# Altium schematic sheet Sheet1.SchDoc
size A3; SheetNumber: 1; SheetTotal: 1
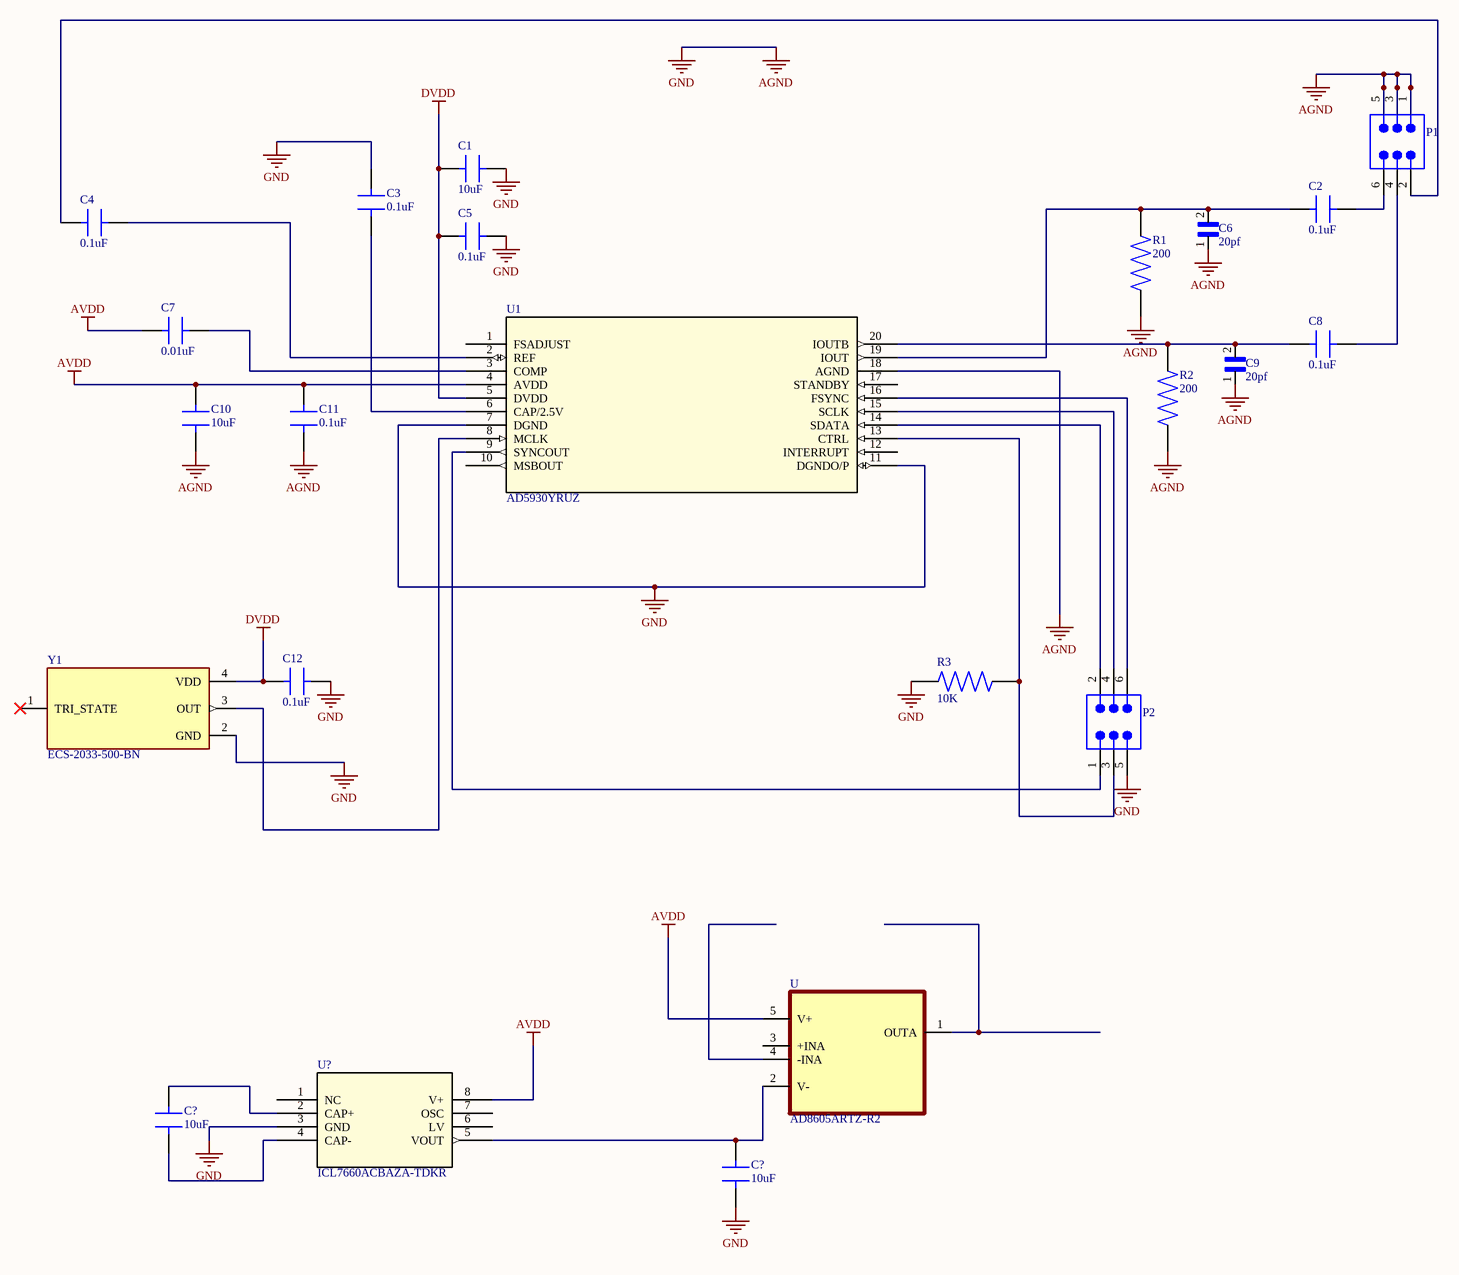
[diagram p0: Sheet1.SchDoc]

## Parts
(Parts that share a designator on the sheet are numbered #1, #2 ... from top to bottom, then left to right.)
C1  10uF  [CAPC1608X100N]
C2  0.1uF  [CHHOT]
C3  0.1uF  [CHHOT]
C4  0.1uF  [CHHOT]
C5  0.1uF  [CHHOT]
C6  20pf  [CAPC1608X87N]
C7  0.01uF  [CHHOT]
C8  0.1uF  [CHHOT]
C9  20pf  [CAPC1608X87N]
C10  10uF  [CAPC1608X100N]
C11  0.1uF  [CHHOT]
C12  0.1uF  [CHHOT]
C?#1  10uF  [CAPC1608X100N]
C?#2  10uF  [CAPC1608X100N]
P1  61200621621  [61200621621]  (value not drawn)
P2  61200621621  [61200621621]  (value not drawn)
R1  200  [RESC1608X55N]
R2  200  [RESC1608X55N]
R3  10K  [RESC1005X35N]
U  AD8605ARTZ-R2  [SOT95P290X145-5N]
U1  AD5930YRUZ  [RU_20_ADI]
U?  ICL7660ACBAZA-TDKR  [SOIC8_4X5_INR]
Y1  ECS-2033-500-BN  [OSC_ECS-2033-500-BN]

## Nets
AGND: C1.1 C3.2 C5.1 C6.1 C9.1 C10.1 C11.1 C12.1 C?#2.1 P1.1 P1.3 P1.5 P2.5 R1.1 R2.1 R3.1 U1.7(DGND) U1.11(DGNDO/P) U1.18(AGND) U?.3(GND) Y1.2(GND)  [also labelled GND]
AVDD: C7.1 C10.2 C11.2 U.5(V+) U1.4(AVDD) U?.8(V+)
DVDD: C1.2 C5.2 C12.2 U1.5(DVDD) Y1.4(VDD)
NetC2_1: C2.1 P1.6
NetC2_2: C2.2 C6.2 R1.2 U1.19(IOUT)
NetC3_1: C3.1 U1.6(CAP/2.5V)
NetC4_1: C4.1 U1.2(REF)
NetC4_2: C4.2 P1.2
NetC7_2: C7.2 U1.3(COMP)
NetC8_1: C8.1 P1.4
NetC8_2: C8.2 C9.2 R2.2 U1.20(IOUTB)
NetC?#1_1: C?#1.1 U?.4(CAP-)
NetC?#1_2: C?#1.2 U?.2(CAP+)
NetC?#2_2: C?#2.2 U.2(V-) U?.5(VOUT)
NetP2_1: P2.1 U1.9(SYNCOUT)
NetP2_2: P2.2 U1.14(SDATA)
NetP2_3: P2.3 R3.2 U1.13(CTRL)
NetP2_4: P2.4 U1.15(SCLK)
NetP2_6: P2.6 U1.16(FSYNC)
NetU1_8: U1.8(MCLK) Y1.3(OUT)

Not connected (* = marked no-connect by the designer): U 1(OUTA) 3(+INA) 4(-INA); U1 1(FSADJUST) 10(MSBOUT) 12(INTERRUPT) 17(STANDBY); U? 1(NC) 6(LV) 7(OSC); Y1 1(TRI_STATE)*

## Library data of the parts
C1 C10 C?#1 C?#2 = GRM188R61A106ME69D: Ceramic Capacitor, Multilayer, Ceramic, 10V, 20% +Tol, 20% -Tol, X5R, 15% TC, 10uF, Surface Mount, 0603; Manufacturer: Murata; Multilayer: Yes; Supplier: Digikey; Supplier Part Number: 490-10475-1-ND; Manufacturer Part Number: GRM188R61A106ME69D; RoHS: Yes; Category: Ceramic Capacitors; Stock: 1017904; Pricing: 1=0.14, 10=0.098, 50=0.0584, 100=0.0459, 500=0.03392, 1000=0.02809 (USD); Mounting Technology: Surface Mount; Pins: 2; Dielectric Material: Ceramic; Package Shape: Rectangular; Case/Package: 0603; Terminal Finish: Nickel; Min Operating Temperature: -55°C; Max Operating Temperature: 85°C; JESD-609 Code: e3; Value: 10uF; Capacitor Type: Ceramic; Tolerance  (fill in as +-): 20%; Packaging: Tape and Reel; Tolerance (fill in as +-): 20%; Rated DC Voltage (URdc): 10V; Temperature Characteristics Code: X5R; Termination: Wraparound; Reach SVHC Compliant: Yes; RoHS Compliant: Yes; ComponentLink1URL: https://datasheet.ciiva.com:443/pdfs/VipMasterIC/IC/MURE/MURE-S-A0004349797/MURE-S-A0004352786-1.pdf?src-supplier=IHS+Markit; ComponentLink1Description: https://datasheet.ciiva.com:443/pdfs/VipMasterIC/IC/MURE/MURE-S-A0004349797/MURE-S-A0004352786-1.pdf?src-supplier=IHS+Markit; ComponentLink2URL: http://www.farnell.com/datasheets/1872210.pdf?src-supplier=Farnell; ComponentLink2Description: http://www.farnell.com/datasheets/1872210.pdf?src-supplier=Farnell; ComponentLink3URL: http://www.mouser.com/ds/2/281/c02e-2905.pdf?src-supplier=Mouser; ComponentLink3Description: http://www.mouser.com/ds/2/281/c02e-2905.pdf?src-supplier=Mouser; ComponentLink4URL: http://www.farnell.com/datasheets/1872210.pdf?src-supplier=Newark; ComponentLink4Description: http://www.farnell.com/datasheets/1872210.pdf?src-supplier=Newark; ComponentLink5URL: http://www.farnell.com/datasheets/2048014.pdf?src-supplier=Element14; ComponentLink5Description: http://www.farnell.com/datasheets/2048014.pdf?src-supplier=Element14; ComponentLink6URL: https://datasheet.octopart.com/GRM188R61A106ME69D-Murata-datasheet-62317187.pdf?src-supplier=Element14; ComponentLink6Description: https://datasheet.octopart.com/GRM188R61A106ME69D-Murata-datasheet-62317187.pdf?src-supplier=Element14; ComponentLink7URL: http://search.murata.co.jp/Ceramy/image/img/A01X/G101/ENG/GRM188R61A106ME69-01.pdf?src-supplier=Digikey; ComponentLink7Description: http://search.murata.co.jp/Ceramy/image/img/A01X/G101/ENG/GRM188R61A106ME69-01.pdf?src-supplier=Digikey; ComponentLink8URL: https://datasheet.octopart.com/GRM188R61A106ME69D-Murata-datasheet-22122223.pdf?src-supplier=Future+Electronics; ComponentLink8Description: https://datasheet.octopart.com/GRM188R61A106ME69D-Murata-datasheet-22122223.pdf?src-supplier=Future+Electronics
C2-C5 C8 C11 C12 = GRM155R71C104KA88J: Ceramic Capacitor, Multilayer, Ceramic, 16V, 10% +Tol, 10% -Tol, X7R, 15% TC, 0.1uF, Surface Mount, 0402; Manufacturer: Murata; Value: 100nF; Multilayer: Yes; Supplier: Digikey; Supplier Part Number: 490-6328-1-ND; Manufacturer Part Number: GRM155R71C104KA88J; RoHS: Yes; Category: Ceramic Capacitors; Stock: 19507793; Pricing: 1=0.1, 10=0.019, 50=0.011, 100=0.0086, 500=0.00646, 1000=0.00508, 2500=0.00462, 5000=0.00425 (USD); Mounting Technology: Surface Mount; Pins: 2; Dielectric Material: Ceramic; Package Shape: Rectangular; Case/Package: 0402; Terminal Finish: Nickel; Min Operating Temperature: -55°C; Max Operating Temperature: 125°C; JESD-609 Code: e3; Capacitor Type: Ceramic; Tolerance  (fill in as +-): 10%; Package Style: SMTMeter; Packaging: Tape and Reel; Tolerance (fill in as +-): 10%; Rated DC Voltage (URdc): 16V; Temperature Characteristics Code: X7R; Termination: Wraparound; Length: 1mm; Width: 0.5mm; Height: 0.5mm; Reach SVHC Compliant: Yes; RoHS Compliant: Yes; ComponentLink1URL: https://psearch.en.murata.com:443/capacitor/product/GRM155R71C104KA88%23.pdf?src-supplier=IHS+Markit; ComponentLink1Description: https://psearch.en.murata.com:443/capacitor/product/GRM155R71C104KA88%23.pdf?src-supplier=IHS+Markit; ComponentLink2URL: https://datasheet.ciiva.com/6271/product-6271168.pdf?src-supplier=Digikey; ComponentLink2Description: https://datasheet.ciiva.com/6271/product-6271168.pdf?src-supplier=Digikey; ComponentLink3URL: https://datasheet.ciiva.com/6271/grm155r71c104ka88-01-6271231.pdf?src-supplier=Digikey; ComponentLink3Description: https://datasheet.ciiva.com/6271/grm155r71c104ka88-01-6271231.pdf?src-supplier=Digikey
C6 C9 = C0603C200C3GAC7867: Package: None; Price: None; Value: *; MP: C0603C200C3GAC7867; Availability: Unavailable
C7 = GRM155R71E103KA01D: Ceramic Capacitor, Multilayer, Ceramic, 25V, 10% +Tol, 10% -Tol, X7R, 15% TC, 0.01uF, Surface Mount, 0402; Manufacturer: Murata; Value: 10nF; Multilayer: Yes; Supplier: Digikey; Supplier Part Number: 490-1312-1-ND; Manufacturer Part Number: GRM155R71E103KA01D; RoHS: Yes; Category: Ceramic Capacitors; Stock: 9603416; Pricing: 1=0.1, 10=0.028, 50=0.016, 100=0.0125, 500=0.00938, 1000=0.00736, 2500=0.0067, 5000=0.00616 (USD); Mounting Technology: Surface Mount; Pins: 2; Dielectric Material: Ceramic; Package Shape: Rectangular; Case/Package: 0402; Terminal Finish: Nickel; Min Operating Temperature: -55°C; Max Operating Temperature: 125°C; JESD-609 Code: e3; Capacitor Type: Ceramic; Tolerance  (fill in as +-): 10%; Package Style: SMTMeter; Packaging: Tape and Reel; Tolerance (fill in as +-): 10%; Rated DC Voltage (URdc): 25V; Temperature Characteristics Code: X7R; Termination: Wraparound; Length: 1mm; Width: 0.5mm; Height: 0.5mm; Reach SVHC Compliant: Yes; RoHS Compliant: Yes; ComponentLink1URL: https://psearch.en.murata.com:443/capacitor/product/GRM155R71E103KA01%23.pdf?src-supplier=IHS+Markit; ComponentLink1Description: https://psearch.en.murata.com:443/capacitor/product/GRM155R71E103KA01%23.pdf?src-supplier=IHS+Markit; ComponentLink2URL: https://datasheet.ciiva.com/28534/1699889-28534148.pdf?src-supplier=Element14; ComponentLink2Description: https://datasheet.ciiva.com/28534/1699889-28534148.pdf?src-supplier=Element14; ComponentLink3URL: https://datasheet.ciiva.com/129/partnumbering-e-01-129742.pdf?src-supplier=Digikey; ComponentLink3Description: https://datasheet.ciiva.com/129/partnumbering-e-01-129742.pdf?src-supplier=Digikey; ComponentLink4URL: https://datasheet.ciiva.com/129/partnumbering-e-01-129741.pdf?src-supplier=Digikey; ComponentLink4Description: https://datasheet.ciiva.com/129/partnumbering-e-01-129741.pdf?src-supplier=Digikey; ComponentLink5URL: https://datasheet.ciiva.com/129/partnumbering-e-01-129743.pdf?src-supplier=Digikey; ComponentLink5Description: https://datasheet.ciiva.com/129/partnumbering-e-01-129743.pdf?src-supplier=Digikey; ComponentLink6URL: https://datasheet.ciiva.com/11786/0900766b807a1cab-11786320.pdf?src-supplier=Rs; ComponentLink6Description: https://datasheet.ciiva.com/11786/0900766b807a1cab-11786320.pdf?src-supplier=Rs; ComponentLink7URL: https://datasheet.ciiva.com/3777/3813grm155r71e103ka0123-3777115.pdf?src-supplier=Arrow+Electronics; ComponentLink7Description: https://datasheet.ciiva.com/3777/3813grm155r71e103ka0123-3777115.pdf?src-supplier=Arrow+Electronics; ComponentLink8URL: https://datasheet.ciiva.com/18184/getdatasheetpartid-161489-18184689.pdf?src-supplier=Verical; ComponentLink8Description: https://datasheet.ciiva.com/18184/getdatasheetpartid-161489-18184689.pdf?src-supplier=Verical; ComponentLink9URL: https://datasheet.ciiva.com/29199/454154-da-01-en-vs-kondensator-0402-29199817.pdf?src-supplier=Conrad; ComponentLink9Description: https://datasheet.ciiva.com/29199/454154-da-01-en-vs-kondensator-0402-29199817.pdf?src-supplier=Conrad; ComponentLink10URL: https://datasheet.ciiva.com/7937/1747448-7937621.pdf?src-supplier=Element14; ComponentLink10Description: https://datasheet.ciiva.com/7937/1747448-7937621.pdf?src-supplier=Element14; ComponentLink11URL: https://datasheet.ciiva.com/16199/product-16199034.pdf?src-supplier=Future+Electronics; ComponentLink11Description: https://datasheet.ciiva.com/16199/product-16199034.pdf?src-supplier=Future+Electronics
P1 P2 = 61200621621: WR-BHD Male Box Header, THT Straight, pitch 2.54mm, 2 row, 6 pin; Manufacturer: Wurth Elektronik; Contact Resistance: 20mOhm; Insulation Resistance: 1000MOhm; Rated Current: 3A; Working Voltage: 250V; Withstanding Voltage: 500V; Manufacturer Part Number: 61200621621; Category: Wire-to-Board Connectors; Match Code: WR-BHD; ComponentLink1Description: Website Link; ComponentLink1URL: https://www.we-online.com/redexpert/article/61200621621?ad; ComponentLink2Description: Datasheet Link; ComponentLink2URL: https://www.we-online.com/redexpert/spec/61200621621?ad; Mount: Through Hole; Operating Temperature Max: 105°C; Operating Temperature Min: -40°C; Packaging: Tray; Length: 15.28mm; Width: 9.1mm; Height: 9.1mm; Gender: Male; Number of Pins: 6; Number of Rows: 2; Orientation: Straight; Pitch: 2.54mm
R1 R2 = ESR03EZPF2000: Res Thick Film 0603 200 Ohm 1% 0.25W(1/4W) Â±100ppm/C Pad SMD Automotive T/R; Package: None; Price: None; Value: *; MP: ESR03EZPF2000; Availability: Unavailable
R3 = RC0402JR-0710KL: Fixed Resistor, Metal Glaze/thick Film, 0.0625W, 10000ohm, 50V, 5% +/-Tol, 100ppm/Cel, Surface Mount, 0402; Manufacturer: Yageo; Additional Feature: LASER TRIMMABLE; Power: 62.5mW; Rated Temperature: 70°C; Value: 10kR; Temperature Coefficient: 100ppm/°C; Package Height: 0.35mm; Package Length: 1mm; Package Width: 0.5mm; Supplier: Future Electronics; Supplier Part Number: 4356762; Manufacturer Part Number: RC0402JR-0710KL; RoHS: Yes; Category: Chip SMD Resistors; Stock: 6530000; Pricing: 10000=0.0014, 100000=0.0007, 150000=0.0013, 300000=0.0007, 500000=0.0013, 750000=0.0007, 1500000=0.0012, 2000000=0.0006, 5000000=0.0011 (USD); Mounting Technology: Surface Mount; Pins: 2; Package Shape: Rectangular; Case/Package: 0402; Terminal Finish: Nickel; Min Operating Temperature: -55°C; Max Operating Temperature: 155°C; Tolerance: 5%; JESD-609 Code: e3; Resistor Type: FIXED RESISTOR; Construction: Chip; Package Style: SMTMeter; Packaging: Tape and Reel; Technology: METAL GLAZE/THICK FILM; Termination: Wraparound; Working Voltage: 50V; Reach SVHC Compliant: Yes; RoHS Compliant: Yes; ComponentLink1URL: https://datasheet.ciiva.com:443/pdfs/VipMasterIC/IC/YAGO/YAGO-S-A0008145938/YAGO-S-A0008145938-1.pdf?src-supplier=IHS+Markit; ComponentLink1Description: https://datasheet.ciiva.com:443/pdfs/VipMasterIC/IC/YAGO/YAGO-S-A0008145938/YAGO-S-A0008145938-1.pdf?src-supplier=IHS+Markit; ComponentLink2URL: https://datasheet.ciiva.com/2452/pyu-r-int-thick-7-2452627.pdf?src-supplier=Digikey; ComponentLink2Description: https://datasheet.ciiva.com/2452/pyu-r-int-thick-7-2452627.pdf?src-supplier=Digikey; ComponentLink3URL: https://datasheet.ciiva.com/2452/pyu-r-int-thick-7-2452628.pdf?src-supplier=Digikey; ComponentLink3Description: https://datasheet.ciiva.com/2452/pyu-r-int-thick-7-2452628.pdf?src-supplier=Digikey; ComponentLink4URL: https://datasheet.ciiva.com/2452/pyu-r-int-thick-7-2452626.pdf?src-supplier=Digikey; ComponentLink4Description: https://datasheet.ciiva.com/2452/pyu-r-int-thick-7-2452626.pdf?src-supplier=Digikey; ComponentLink5URL: https://datasheet.ciiva.com/12669/pyu-rc0402-51-rohs-l-6-r-12669687.pdf?src-supplier=Mouser; ComponentLink5Description: https://datasheet.ciiva.com/12669/pyu-rc0402-51-rohs-l-6-r-12669687.pdf?src-supplier=Mouser; ComponentLink6URL: https://datasheet.ciiva.com/7850/1018594-7850137.pdf?src-supplier=Element14; ComponentLink6Description: https://datasheet.ciiva.com/7850/1018594-7850137.pdf?src-supplier=Element14; ComponentLink7URL: https://datasheet.ciiva.com/7850/1018594-7850136.pdf?src-supplier=Element14; ComponentLink7Description: https://datasheet.ciiva.com/7850/1018594-7850136.pdf?src-supplier=Element14
U = AD8605ARTZ-R2: General Purpose Amplifier 1 Circuit Rail-to-Rail SOT-23-5; MF: Analog Devices; MP: AD8605ARTZ-REEL7; SnapEDA_Link: https://www.snapeda.com/parts/AD8605ARTZ-REEL7/Analog%20Devices%20Inc./view-part/49928/?ref=snap; Price: None; Availability: Unavailable; Package: SOT-23-5 Analog Devices; Value: *
U1 = AD5930YRUZ: No Description Available; Mfr_Name: Analog Devices Inc; RefDes: RefDes; Type: Type
U? = ICL7660ACBAZA-TDKR: No Description Available; Mfr_Name: Renesas / Intersil; RefDes: RefDes; Type: Type
Y1 = ECS-2033-500-BN: subminiature SMD oscillators <a href="https://pricing.snapeda.com/parts/ECS-2033-500-BN/ECS%20Inc./view-part?ref=eda">Check availability</a>; MF: {'manufacturer': u'ECS Inc.'}; Package: None; Price: None; Value: *; MP: ECS-2033-500-BN; Availability: Unavailable